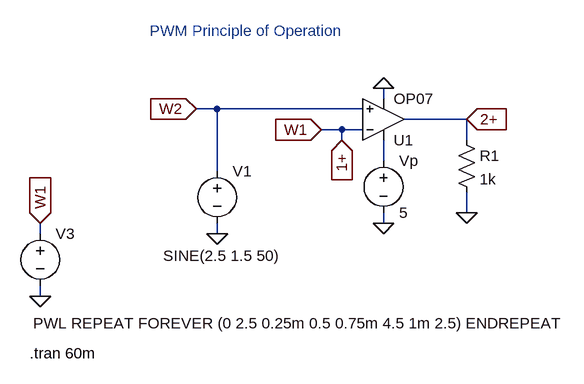
[diagram p0: schematic pwm_carrier_ltspice.asc]
pwm_carrier_ltspice.asc, the LTspice schematic file:
Version 4
SHEET 1 880 680
WIRE 368 272 368 256
WIRE 112 288 80 288
WIRE 336 288 112 288
WIRE 496 304 400 304
WIRE 304 320 272 320
WIRE 336 320 304 320
WIRE 304 336 304 320
WIRE 496 336 496 304
WIRE 368 368 368 336
WIRE 112 384 112 288
WIRE 496 448 496 416
WIRE 368 464 368 448
WIRE -160 480 -160 464
WIRE 112 480 112 464
WIRE -160 576 -160 560
FLAG 368 256 0
FLAG 80 288 W2
IOPIN 80 288 In
FLAG 272 320 W1
IOPIN 272 320 In
FLAG 496 448 0
FLAG 496 304 2+
IOPIN 496 304 In
FLAG 304 336 1+
IOPIN 304 336 In
FLAG 112 480 0
FLAG -160 464 W1
IOPIN -160 464 In
FLAG -160 576 0
FLAG 368 464 0
SYMBOL res 480 320 R0
SYMATTR InstName R1
SYMATTR Value 1k
SYMBOL voltage 112 368 R0
WINDOW 3 -83 146 Left 2
WINDOW 123 0 0 Left 0
WINDOW 39 0 0 Left 0
SYMATTR Value SINE(2.5 1.5 50)
SYMATTR InstName V1
SYMBOL voltage 368 352 R0
WINDOW 123 0 0 Left 0
WINDOW 39 0 0 Left 0
SYMATTR InstName Vp
SYMATTR Value 5
SYMBOL voltage -160 464 R0
WINDOW 3 -11 154 Left 2
SYMATTR Value PWL REPEAT FOREVER (0 2.5 0.25m 0.5 0.75m 4.5 1m 2.5) ENDREPEAT
SYMATTR InstName V3
SYMBOL Opamps\\OP07 368 368 M180
SYMATTR InstName U1
TEXT 8 168 Left 2 ;PWM Principle of Operation
TEXT -176 664 Left 2 !.tran 60m

The netlist it stands for:
* pwm_carrier_ltspice.asc
R1 2+ 0 1k
V1 W2 0 SINE(2.5 1.5 50)
Vp N001 0 5
V3 1+ 0 PWL REPEAT FOREVER (0 2.5 0.25m 0.5 0.75m 4.5 1m 2.5) ENDREPEAT
XU1 W2 1+ N001 0 2+ LT1001  ; OP07, pins In+ In- V+ V- OUT
* PWM Principle of Operation
.tran 60m
.lib LTC.lib
.backanno
.end